# Altium project Ecualizador.PrjPcb
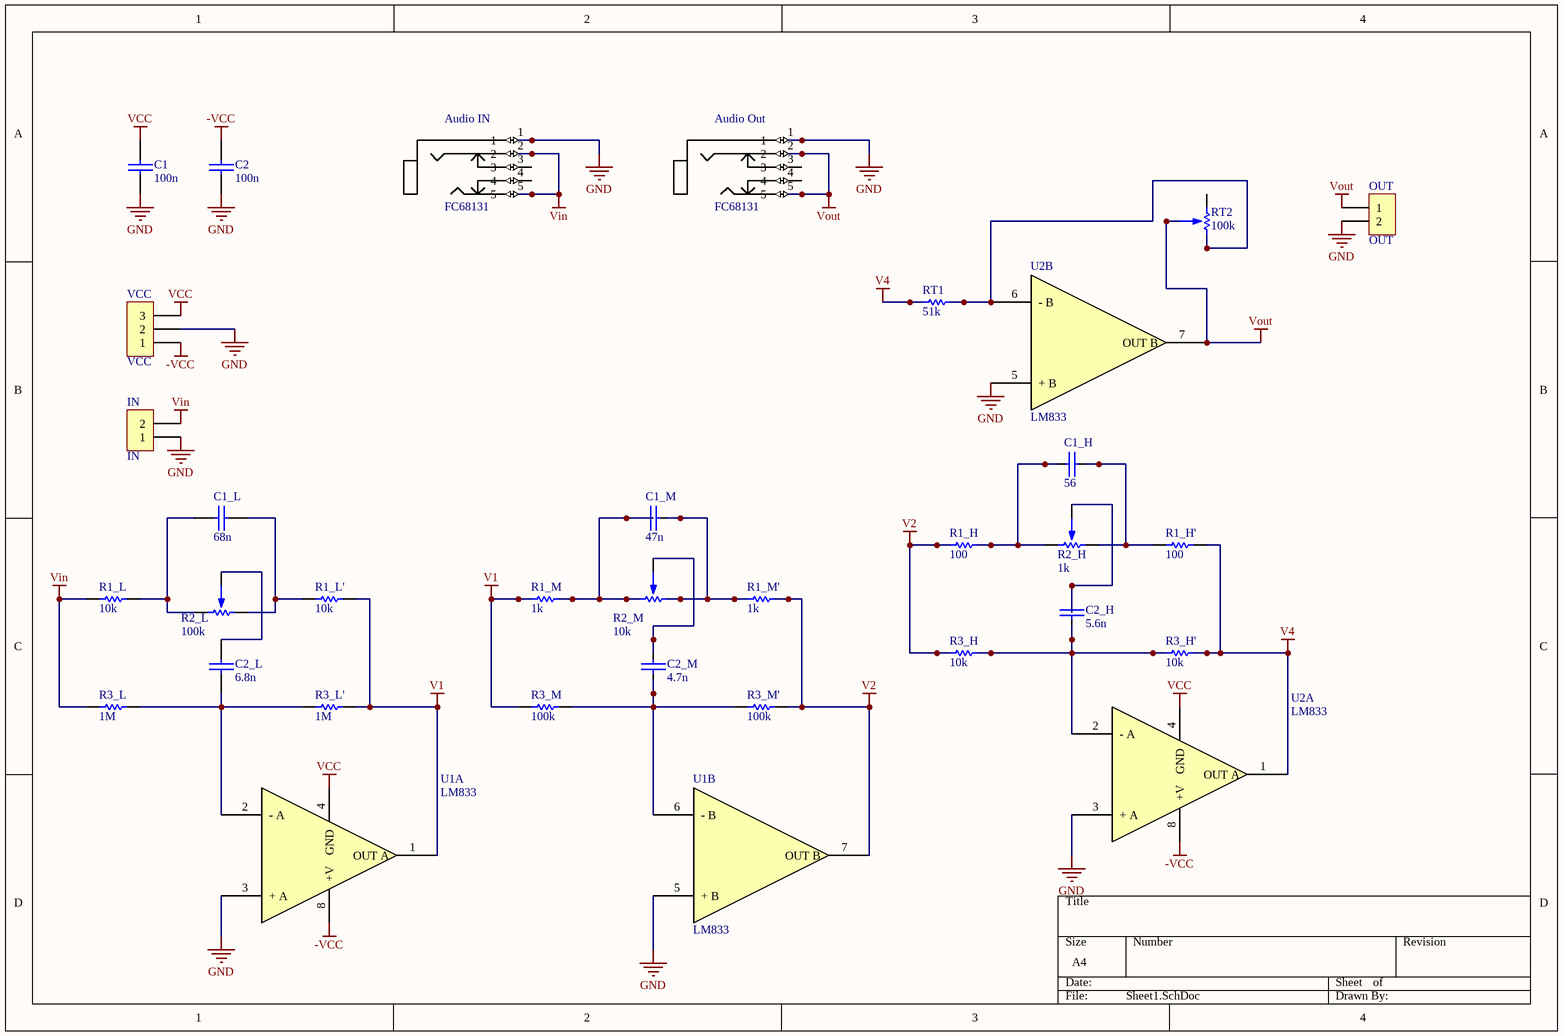
[diagram p0: Sheet1.SchDoc]
1 sheet, 32 parts. Net scope: global (net labels, ports and power ports of the same name join across sheets).
Board file: PCB1.PcbDoc

## Sheet Sheet1.SchDoc
size A4

### Parts
Audio_IN  FC68131  [*FC68131-5P]
Audio_Out  FC68131  [*FC68131-5P]
C1  100n  [0805]
C1_H  56  [0805]
C1_L  68n  [0805]
C1_M  47n  [0805]
C2  100n  [0805]
C2_H  5.6n  [0805]
C2_L  6.8n  [0805]
C2_M  4.7n  [0805]
IN  IN  [BORNERA2]
OUT  OUT  [BORNERA2]
R1_H  100  [0805]
R1_H'  100  [0805]
R1_L  10k  [0805]
R1_L'  10k  [0805]
R1_M  1k  [0805]
R1_M'  1k  [0805]
R2_H  1k  [POTENCIOMETRO]
R2_L  100k  [POTENCIOMETRO]
R2_M  10k  [POTENCIOMETRO]
R3_H  10k  [0805]
R3_H'  10k  [0805]
R3_L  1M  [1206]
R3_L'  1M  [1206]
R3_M  100k  [0805]
R3_M'  100k  [0805]
RT1  51k  [0805]
RT2  100k  [POTENCIOMETRO]
U1  LM833  [DIP8]  (parts A,B of 2)
U2  LM833  [DIP8]  (parts A,B of 2)
VCC  VCC  [BORNERA3]

### Nets
-VCC: C2.1 U1.8(+V) U2.8(+V) VCC.1
GND: Audio_IN.1 Audio_Out.1 C1.2 C2.2 IN.1 OUT.2 U1.3(+_A) U1.5(+_B) U2.3(+_A) U2.5(+_B) VCC.2
V1: R1_L'.2 R1_M.1 R3_L'.2 R3_M.1 U1.1(OUT_A)
V2: R1_H.1 R1_M'.2 R3_H.1 R3_M'.2 U1.7(OUT_B)
V4: R1_H'.2 R3_H'.2 RT1.1 U2.1(OUT_A)
VCC: C1.1 U1.4(GND) U2.4(GND) VCC.3
Vin: Audio_IN.2 Audio_IN.5 IN.2 R1_L.1 R3_L.1
Vout: Audio_Out.2 Audio_Out.5 OUT.1 RT2.2 U2.7(OUT_B)
NetC1_H_1: C1_H.1 R1_H.2 R2_H.1
NetC1_H_2: C1_H.2 R1_H'.1 R2_H.3
NetC1_L_1: C1_L.1 R1_L.2 R2_L.1
NetC1_L_2: C1_L.2 R1_L'.1 R2_L.3
NetC1_M_1: C1_M.1 R1_M.2 R2_M.1
NetC1_M_2: C1_M.2 R1_M'.1 R2_M.3
NetC2_H_1: C2_H.1 R2_H.2
NetC2_H_2: C2_H.2 R3_H.2 R3_H'.1 U2.2(-_A)
NetC2_L_1: C2_L.1 R2_L.2
NetC2_L_2: C2_L.2 R3_L.2 R3_L'.1 U1.2(-_A)
NetC2_M_1: C2_M.1 R2_M.2
NetC2_M_2: C2_M.2 R3_M.2 R3_M'.1 U1.6(-_B)
NetRT1_2: RT1.2 RT2.1 U2.6(-_B)

Not connected (* = marked no-connect by the designer): Audio_IN 3 4; Audio_Out 3 4; RT2 3

### Library data of the parts
Audio_IN Audio_Out = FC68131: Stereo Jack, 3.5mm, 3pos, Pcb; MF: Cliff; Availability: Unavailable; Price: None; MP: FC68131; Package: None; SnapEDA_Link: https://www.snapeda.com/parts/FC68131/Cliff%20Electronics/view-part/?ref=snap; Value: *
C1 C1_H C1_L C1_M C2 C2_H C2_L C2_M = CAP
IN OUT = BORNERA 2
R1_H R1_H' R1_L R1_L' R1_M R1_M' R3_H R3_H' R3_L R3_L' R3_M R3_M' RT1 = RES
R2_H R2_L R2_M RT2 = POTENCIOMETRO
U1 U2 = LM833: Dual Audio Operational Amplifier
VCC = BORNERA 3